# Altium schematic sheet sch_cm4_pwr.SchDoc
size A4; SheetNumber: 4; SheetTotal: 7
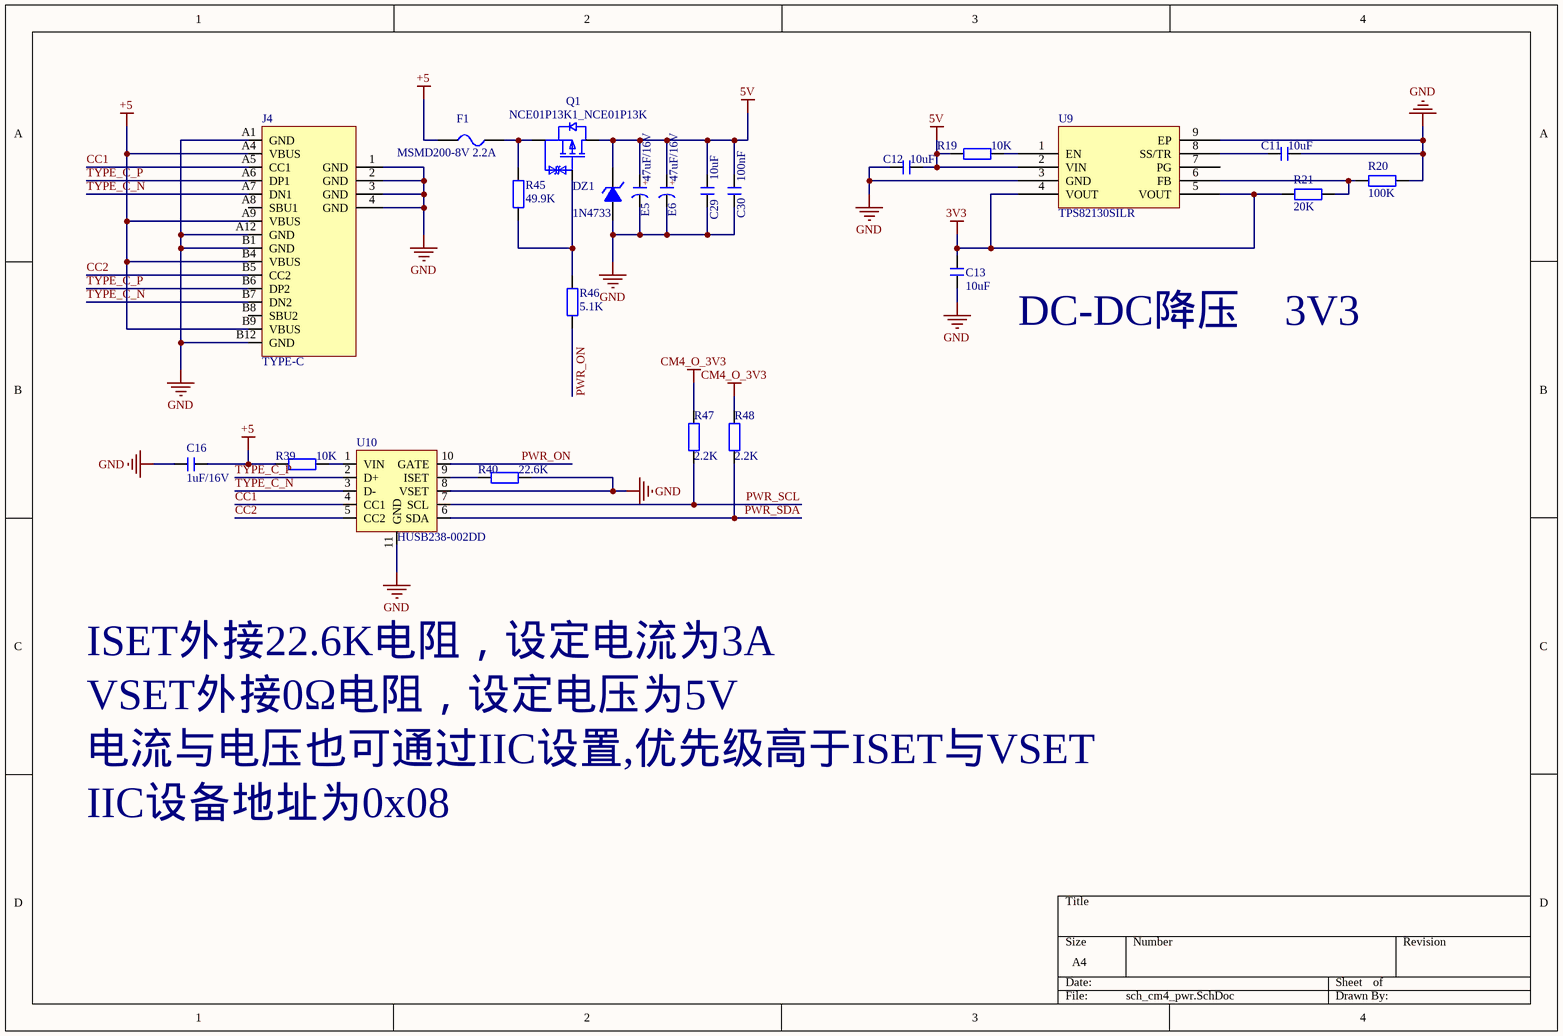
[diagram p0: sch_cm4_pwr.SchDoc]

## Parts
C11  10uF  [C 0805_L]
C12  10uF  [C 0805_L]
C13  10uF  [C 0805_L]
C16  1uF/16V  [C 0805_L]
C29  10uF  [C 0805_L]
C30  100nF  [C 0805_L]
DZ1  1N4733  [SMA]
E5  47uF/16V  [CD B(3528)]
E6  47uF/16V  [CD B(3528)]
F1  MSMD200-8V 2.2A  [FU 1812]
J4  TYPE-C  [TYPE-C USB3.1]
Q1  NCE01P13K1_NCE01P13K  [TO-252-2_L6.6-W6.1-P4.57-LS10.1-TL-CW]
R19  10K  [R 0805_L]
R20  100K  [R 0805_L]
R21  20K  [R 0805_L]
R39  10K  [R 0805_L]
R40  22.6K  [R 0805_L]
R45  49.9K  [R 0805_L]
R46  5.1K  [R 0805_L]
R47  2.2K  [R 0805_L]
R48  2.2K  [R 0805_L]
U9  TPS82130SILR  [TPS82130SILR]
U10  HUSB238-002DD  [DFN-10_L3.0-W3.0-P0.50-BL-EP2.5]

## Nets
3V3: C13.2 R21.1 U9.4(VOUT) U9.5(VOUT)
5V: C12.2 C29.2 C30.2 DZ1.2(K) E5.1(A) E6.1(A) Q1.2(D) R19.1 U9.2(VIN)
+5: C16.1 F1.1 J4.A4(VBUS) J4.A9(VBUS) J4.B4(VBUS) J4.B9(VBUS) R39.1
CM4_O_3V3: R47.2 R48.2
GND: C11.2 C12.1 C13.1 C16.2 C29.1 C30.1 DZ1.1(A) E5.2(K) E6.2(K) J4.1(GND) J4.2(GND) J4.3(GND) J4.4(GND) J4.A1(GND) J4.A12(GND) J4.B1(GND) J4.B12(GND) R20.2 R40.2 U9.3(GND) U9.9(EP) U10.8(VSET) U10.11(GND)
CC1: J4.A5(CC1) U10.4(CC1)
CC2: J4.B5(CC2) U10.5(CC2)
PWR_ON: R46.1 U10.10(GATE)
PWR_SCL: R47.1 U10.7(SCL)
PWR_SDA: R48.1 U10.6(SDA)
TYPE_C_N: J4.A7(DN1) J4.B7(DN2) U10.3(D-)
TYPE_C_P: J4.A6(DP1) J4.B6(DP2) U10.2(D+)
NetC11_1: C11.1 U9.8(SS/TR)
NetF1_2: F1.2 Q1.3(S) R45.2
NetQ1_1: Q1.1(G) R45.1 R46.2
NetR19_2: R19.2 U9.1(EN)
NetR20_1: R20.1 R21.2 U9.6(FB)
NetR39_2: R39.2 U10.1(VIN)
NetR40_1: R40.1 U10.9(ISET)

Not connected (* = marked no-connect by the designer): J4 A8(SBU1) B8(SBU2); U9 7(PG)

## Notes on the sheet
- DC-DC降压    3V3
- ISET外接22.6K电阻，设定电流为3A
- VSET外接0Ω电阻，设定电压为5V
- 电流与电压也可通过IIC设置,优先级高于ISET与VSET
- IIC设备地址为0x08
- (in symbol CT) +

## Library data of the parts
C11-C13 C16 C29 C30 = C: 贴片电容; BOM名称: 无极性贴片电容; 淘宝ID: 封装库来自淘宝 ID：黄晶宝石; 联系售后，技术支持: https://shop463601444.taobao.com; 唯一出售店铺网址: https://shop463601444.taobao.com
DZ1 = 1N4733: 5.1V/1W稳压管; 版权归属: 封装库来自淘宝 ID：黄晶宝石; BOM名称: 5.1V/1W稳压管; 学习资源: https://item.taobao.com/item.htm?id=566775463719
E5 E6 = CT: 贴片钽电容; 淘宝ID: 封装库来自淘宝 ID：黄晶宝石; BOM名称: 贴片钽电容; 联系售后: https://item.taobao.com/item.htm?id=566775463719
F1 = FU: 贴片保险丝; 版权归属: 封装库来自淘宝卖家 ID：黄晶宝石; BOM名称: 贴片保险丝; 学习资源: https://shop463601444.taobao.com
Q1 = NCE01P13K1_NCE01P13K: PMOS
R19-R21 R39 R40 R45-R48 = R: 贴片电阻; 版权归属: 来自淘宝 ID：黄晶宝石; 封装库来自淘宝卖家 ID：黄晶宝石: 其他店铺购入均为盗版，不享受售后技术支持服务，请立即申请退款; BOM名称: 贴片电阻; 联系售后: https://item.taobao.com/item.htm?id=566775463719
U9 = TPS82130SILR: DC-DC
U10 = HSB38_002DD: IC